# EasyEDA Pro project ProProject_赤兔主板（夜燕flex）_2024-07-11.epro, schematic 夜燕Flex
Create Date: 2024-04-10; Page Name: Sheet_1; Project Name: 夜燕Flex_2024-04-10_11-28-54; Schematic Name: 夜燕Flex; Update Date: 2024-05-22; Company: 嘉立创EDA; Page Size: A3; Version: V1.0
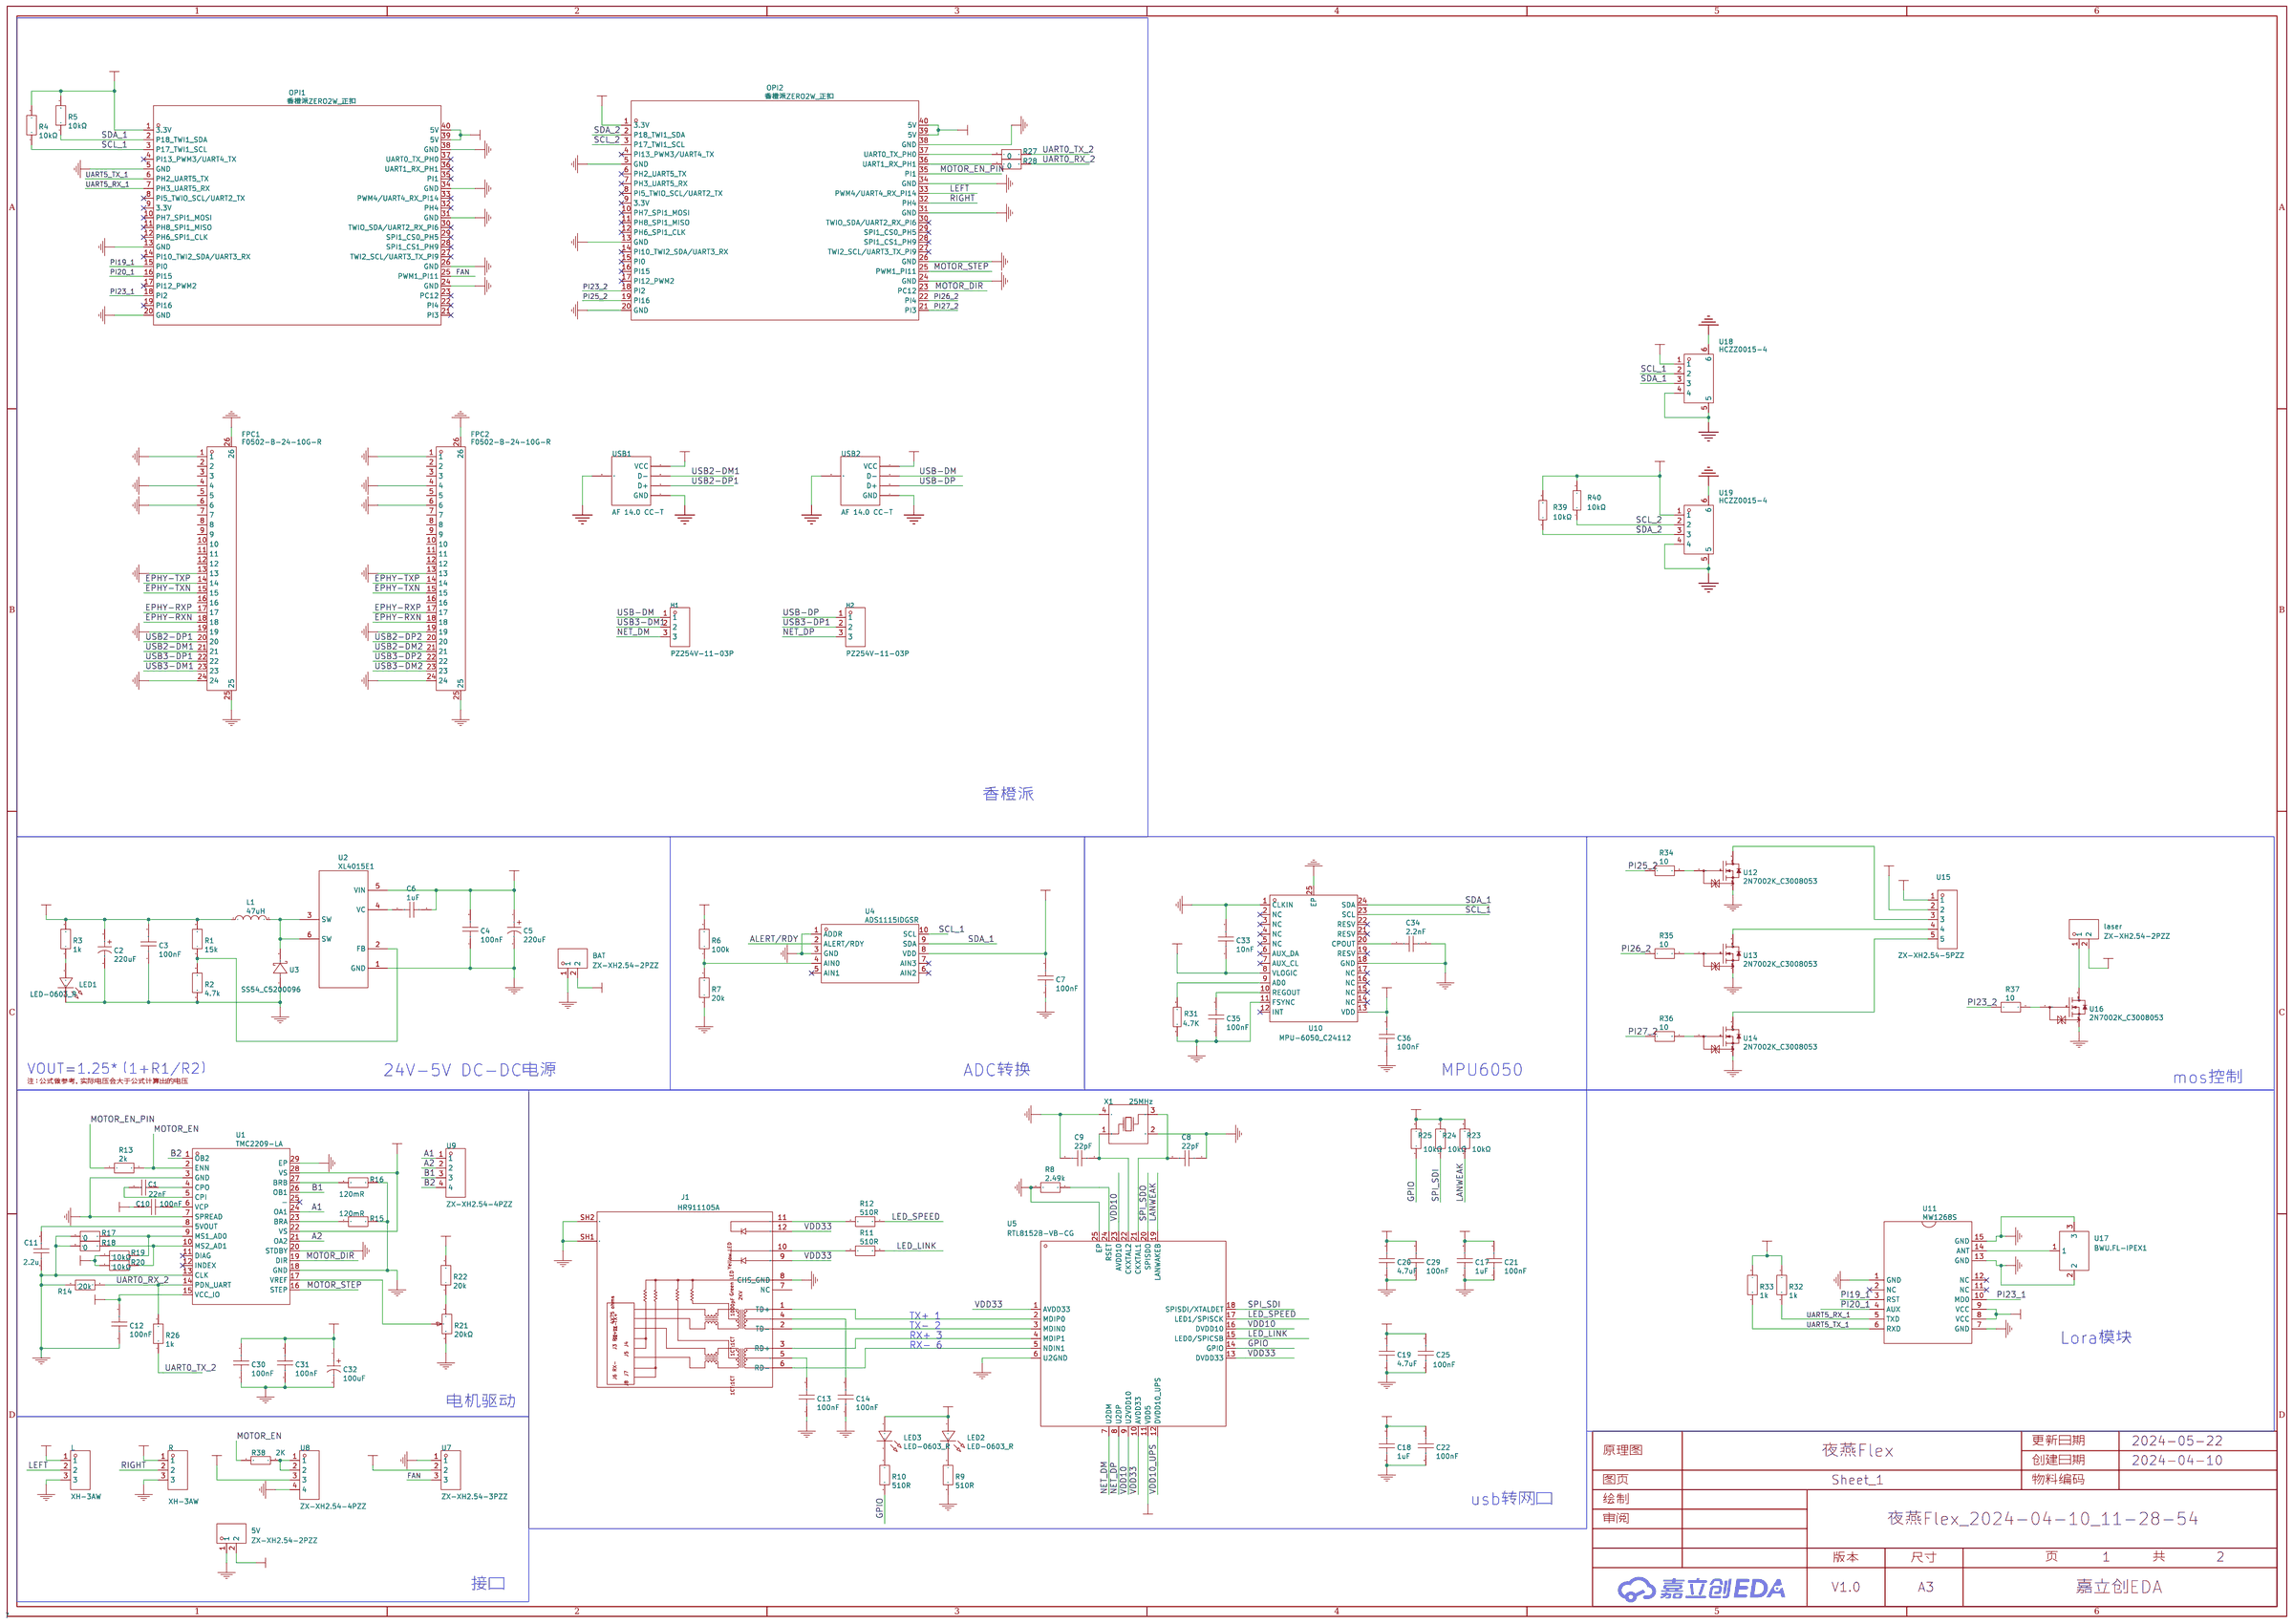
[diagram p0: schematic sheet]

## Parts
5V  ZX-XH2.54-2PZZ  [CONN-TH_2P-P2.50_HX25003-2A]
BAT  ZX-XH2.54-2PZZ  [CONN-TH_2P-P2.50_HX25003-2A]
C1  22nF  [C0603]
C2  220uF  [CAP-SMD_BD10.0-L10.3-W10.3-LS11.0-FD]
C3  100nF  [C0603]
C4  100nF  [C0603]
C5  220uF  [CAP-SMD_BD10.0-L10.3-W10.3-LS11.0-FD]
C6  1uF  [C0603]
C7  100nF  [C0603]
C8  22pF  [footprint_d276]
C9  22pF  [footprint_d276]
C10  100nF  [C0603]
C11  2.2u  [footprint_d276]
C12  100nF  [C0603]
C13  100nF  [C0603]
C14  100nF  [C0603]
C17  1uF  [C0603]
C18  1uF  [C0603]
C19  4.7uF  [C0603]
C20  4.7uF  [C0603]
C21  100nF  [C0603]
C22  100nF  [C0603]
C25  100nF  [C0603]
C29  100nF  [C0603]
C30  100nF  [C0603]
C31  100nF  [C0603]
C32  100uF  [CAP-SMD_BD6.3-L6.6-W6.6-LS7.4-FD]
C33  10nF  [C0603]
C34  2.2nF  [C0603]
C35  100nF  [C0603]
C36  100nF  [C0603]
FPC1  F0502-B-24-10G-R  [FPC-SMD_F0502-B-24-10G-R]
FPC2  F0502-B-24-10G-R  [FPC-SMD_F0502-B-24-10G-R]
H1  PZ254V-11-03P  [HDR-TH_3P-P2.54-V-M]
H2  PZ254V-11-03P  [HDR-TH_3P-P2.54-V-M]
J1  HR911105A  [RJ45-TH_HR911105A]
L  XH-3AW  [CONN-TH_3P-P2.54_HCTL_XH-3AW]
L1  47uH  [IND-SMD_L13.8-W12.6_YSPI13XX]
laser  ZX-XH2.54-2PZZ  [CONN-TH_2P-P2.50_HX25003-2A]
LED1  LED-0603_R  [footprint_3abe]
LED2  LED-0603_R  [footprint_3abe]
LED3  LED-0603_R  [footprint_3abe]
OPI1  香橙派ZERO2W_正扣  [footprint_d6d0]
OPI2  香橙派ZERO2W_正扣  [footprint_d6d0]
R  XH-3AW  [CONN-TH_3P-P2.54_HCTL_XH-3AW]
R1  15k  [footprint_b147]
R2  4.7k  [footprint_b147]
R3  1k  [footprint_b147]
R4  10kΩ  [R0603]
R5  10kΩ  [R0603]
R6  100k  [footprint_b147]
R7  20k  [footprint_b147]
R8  2.49k  [footprint_b147]
R9  510R  [footprint_b147]
R10  510R  [footprint_b147]
R11  510R  [footprint_b147]
R12  510R  [footprint_b147]
R13  2k  [footprint_b147]
R14  20k  [footprint_b147]
R15  120mR  [footprint_b147]
R16  120mR  [footprint_b147]
R17  0  [footprint_b147]
R18  0  [footprint_b147]
R19  10kΩ  [R0603]
R20  10kΩ  [R0603]
R21  20kΩ  [footprint_3e76]
R22  20k  [footprint_b147]
R23  10kΩ  [R0603]
R24  10kΩ  [R0603]
R25  10kΩ  [R0603]
R26  1k  [footprint_b147]
R27  0  [footprint_b147]
R28  0  [footprint_b147]
R31  4.7K  [R0603]
R32  1k  [R0603]
R33  1k  [R0603]
R34  10  [R0603]
R35  10  [R0603]
R36  10  [R0603]
R37  10  [R0603]
R38  2K  [R0603]
R39  10kΩ  [R0603]
R40  10kΩ  [R0603]
U1  TMC2209-LA  [footprint_e6f4]
U2  XL4015E1  [footprint_c660]
U3  SS54_C5200096  [footprint_a0e0]
U4  ADS1115IDGSR  [footprint_abbe]
U5  RTL8152B-VB-CG  [footprint_86b9]
U7  ZX-XH2.54-3PZZ  [CONN-TH_3P-P2.54_2501S-3P]
U8  ZX-XH2.54-4PZZ  [CONN-TH_4P-P2.50_4PIN]
U9  ZX-XH2.54-4PZZ  [CONN-TH_4P-P2.50_4PIN]
U10  MPU-6050_C24112  [QFN-24_L4.0-W4.0-P0.50-BL-EP2.7]
U11  MW1268S  [MW1268S]
U12  2N7002K_C3008053  [SOT-23-3_L2.9-W1.3-P1.90-LS2.4-BL-1]
U13  2N7002K_C3008053  [SOT-23-3_L2.9-W1.3-P1.90-LS2.4-BL-1]
U14  2N7002K_C3008053  [SOT-23-3_L2.9-W1.3-P1.90-LS2.4-BL-1]
U15  ZX-XH2.54-5PZZ  [CONN-TH_5P-P2.50_ZX-XH2.54-5PZZ]
U16  2N7002K_C3008053  [SOT-23-3_L2.9-W1.3-P1.90-LS2.4-BL-1]
U17  BWU.FL-IPEX1  [IPEX-SMD_BWIPX-1-001E]
U18  HCZZ0015-4  [CONN-SMD_4P-P1.25_HCZZ0015-4]
U19  HCZZ0015-4  [CONN-SMD_4P-P1.25_HCZZ0015-4]
USB1  AF 14.0 CC-T  [USB-A-TH_AF14.0CC-T]
USB2  AF 14.0 CC-T  [USB-A-TH_AF14.0CC-T]
X1  25MHz  [OSC-SMD_4P-L3.2-W2.5-BL]

## Library data of the parts
5V BAT laser = ZX-XH2.54-2PZZ: 插针结构:1x2P;间距:2.54mm;安装方式:直插;参考系列:XH;总PIN数:2P;排数:1;每排PIN数:2;行距:-;额定电流:3A;触头材质:黄铜;触头镀层:锡;工作温度范围:-25℃~+85℃;; Supplier Part: C7429632; Manufacturer: Megastar(兆星); Supplier Footprint: 插件,P=2.54mm; JLCPCB Part Class: 扩展库; Datasheet: https://atta.szlcsc.com/upload/public/pdf/source/20230619/19BA6947230AA44A04D3EDD65E618FD0.pdf; Supplier: LCSC; Pins Structure: 1x2P; Pitch: 2.54mm; Mounting Style: 直插; Reference Series: XH; Number of Pins: 2P; Number of Rows: 1; Number of PINs Per Row: 2; Current Rating (Max): 3A; Contact Material: 黄铜; Contact Plating: 锡; Operating Temperature Range: -25℃~+85℃
C1 = CL10B223KB8NNNC: 容值:22nF;精度:±10%;额定电压:50V;材质(温度系数):X7R;; LCSC Part Name: 22nF ±10% 50V; Supplier Part: C21122; Manufacturer: SAMSUNG(三星); Supplier Footprint: 0603; JLCPCB Part Class: Basic Part; Datasheet: https://atta.szlcsc.com/upload/public/pdf/source/20160218/1457707763339.pdf; Supplier: LCSC; Tolerance: ±10%; Voltage Rated: 50V; Temperature Coefficient: X7R
C2 C5 = RVT220UF50V67RV0021: 容值:220uF;精度:±20%;额定电压:50V;纹波电流:230mA@120Hz;等效串联电阻:-;; LCSC Part Name: 220uF ±20% 50V; Supplier Part: C2887271; Manufacturer: KNSCHA(科尼盛); Supplier Footprint: SMD,D10xL10.2mm; JLCPCB Part Class: Extended Part; Datasheet: https://atta.szlcsc.com/upload/public/pdf/source/20210824/08E695BB4B7EEB96F38ACC5D13E6017A.pdf; Supplier: LCSC; Tolerance: ±20%; Rated Voltage: 50V; Ripple Current: 230mA@120Hz; φD: 10mm; L: 10.2mm; Lifetime @ Temp: 2000hrs@105℃; Operating Temperature: -55℃~+105℃
C3 C4 C7 C10 C12-C14 C21 C22 C25 C29-C31 C35 C36 = CC0603KRX7R9BB104: 容值:100nF;精度:±10%;额定电压:50V;材质(温度系数):X7R;; LCSC Part Name: 100nF ±10% 50V; Supplier Part: C14663; Manufacturer: YAGEO(国巨); Supplier Footprint: 0603; JLCPCB Part Class: Basic Part; Datasheet: https://atta.szlcsc.com/upload/public/pdf/source/20180910/C282072_33301C7F631E79921B82A8DAC6BCC5B3.pdf; Supplier: LCSC; Tolerance: ±10%; Voltage Rated: 50V; Temperature Coefficient: X7R
C6 C17 C18 = CL10A105KB8NNNC: 容值:1uF;精度:±10%;额定电压:50V;材质(温度系数):X5R;; LCSC Part Name: 1uF ±10% 50V; Supplier Part: C15849; Manufacturer: SAMSUNG(三星); Supplier Footprint: 0603; JLCPCB Part Class: Basic Part; Datasheet: https://atta.szlcsc.com/upload/public/pdf/source/20160218/1457707763339.pdf; Supplier: LCSC; Tolerance: ±10%; Voltage Rated: 50V; Temperature Coefficient: X5R
C8 C9 = 22pF
C11 = 2.2u
C19 C20 = CL10A475KO8NNNC: 容值:4.7uF;精度:±10%;额定电压:16V;材质(温度系数):X5R;; LCSC Part Name: 4.7uF ±10% 16V; Supplier Part: C19666; Manufacturer: SAMSUNG(三星); Supplier Footprint: 0603; JLCPCB Part Class: Basic Part; Datasheet: https://atta.szlcsc.com/upload/public/pdf/source/20160218/1457707763339.pdf; Supplier: LCSC; Tolerance: ±10%; Voltage Rated: 16V; Temperature Coefficient: X5R
C32 = RVT100UF35V67RV0034: 容值:100uF;精度:±20%;额定电压:35V;纹波电流:87mA@120kHz;等效串联电阻:-;; LCSC Part Name: 100uF ±20% 35V; Supplier Part: C2836442; Manufacturer: KNSCHA(科尼盛); Supplier Footprint: SMD,D6.3xL7.7mm; JLCPCB Part Class: Extended Part; Datasheet: https://atta.szlcsc.com/upload/public/pdf/source/20210528/C2836442_7F6389BF36F63F32D6DF3A507E8E95D6.pdf; Supplier: LCSC; Tolerance: ±20%; Rated Voltage: 35V; Ripple Current: 87mA@120kHz; φD: 6.3mm; L: 7.7mm; Lifetime @ Temp: 2000hrs@105℃; Operating Temperature: -55℃~+105℃
C33 = CC0603KRX7R9BB103: 容值:10nF;精度:±10%;额定电压:50V;材质(温度系数):X7R;; LCSC Part Name: 10nF ±10% 50V; Supplier Part: C100042; Manufacturer: YAGEO(国巨); Supplier Footprint: 0603; JLCPCB Part Class: Extended Part; Datasheet: https://atta.szlcsc.com/upload/public/pdf/source/20181008/C309510_22F155564471FAF6A489F7D68F34234E.pdf; Supplier: LCSC; Tolerance: ±10%; Voltage Rated: 50V; Temperature Coefficient: X7R
C34 = 0603B222K500NT: 容值:2.2nF;精度:±10%;额定电压:50V;材质(温度系数):X7R;; LCSC Part Name: 2.2nF ±10% 50V; Supplier Part: C1604; Manufacturer: FH(风华); Supplier Footprint: 0603; JLCPCB Part Class: Basic Part; Datasheet: https://atta.szlcsc.com/upload/public/pdf/source/20200305/C486355_26A10D38EF8C2A5C37091D0039909270.pdf; Supplier: LCSC; Tolerance: ±10%; Voltage Rated: 50V; Temperature Coefficient: X7R
FPC1 FPC2 = F0502-B-24-10G-R: 锁定特性:翻盖式;触点类型:下接;触点数量:24P;间距:0.5mm;安装类型:卧贴;; LCSC Part Name: 间距:0.5mm P数:24P 翻盖式 下接; Supplier Part: C512913; Manufacturer: XFCN(兴飞); Supplier Footprint: SMD,P=0.5mm,卧贴; JLCPCB Part Class: 扩展库; Datasheet: https://atta.szlcsc.com/upload/public/pdf/source/20200414/C512913_E6E4687019ED01A465E23E78A69614FB.pdf; Supplier: LCSC; Locking Feature: 翻盖式; Contact Type: 下接; Number of Contacts: 24P; Pitch: 0.5mm; Mounting Type: 卧贴; FFC, FCB Thickness: 0.3mm; Height Above Board: 1mm
H1 H2 = PZ254V-11-03P: 插针结构:1x3P;间距:2.54mm;行距:-;圆针/方针:方针;安装类型:直插;排数:单排;总PIN位数:3P;额定电流:3A;额定电压:250V;配合针长度:6mm;塑高:2.5mm;端接针长度:3mm;工作温度范围:-40℃~+105℃;颜色:黑色;; LCSC Part Name: 间距:2.54mm 1x3P 直插 方针; Supplier Part: C2937625; Manufacturer: XFCN(兴飞); Supplier Footprint: 插件,P=2.54mm; JLCPCB Part Class: 扩展库; Datasheet: https://atta.szlcsc.com/upload/public/pdf/source/20200309/C492402_8335C3D49C4E4C618838D59BB1D024C1.pdf; Supplier: LCSC; Pin Structure: 1x3P; Pitch: 2.54mm; Circluar Pins/Square Pins: 方针; Mounting Type: 直插; Number of Rows: 单排; Number of Pins: 3P; Current Rating (Max): 3A; Voltage Rating (Max): 250V; Length of Mating Pin: 6mm; Insulation Height: 2.5mm; Length of End Connection Pin: 3mm; Operating Temperature Range: -40℃~+105℃; Color: 黑色
J1 = HR911105A_C12074: 连接器类型:RJ45插座;端口数量:1;安装方式:-;屏蔽:-;LED:带LED;等级:-;触头材质:-;触头镀层:-;工作温度范围:-;焊接温度(最大值):-;; LCSC Part Name: 带LED; Supplier Part: C12074; Manufacturer: HANRUN(汉仁); Supplier Footprint: 插件; JLCPCB Part Class: Extended Part; Datasheet: https://atta.szlcsc.com/upload/public/pdf/source/20170918/C12074_1505726819496976146.pdf; Supplier: LCSC; Connector Type: RJ45插座; Number of Ports: 1; LED: 带LED; PoE: 不带PoE; Supplementary Features: 带滤波
L R = XH-3AW_C2908612: 插针结构:1x3P;间距:2.54mm;安装方式:弯插;参考系列:XH;总PIN数:3P;排数:1;每排PIN数:3;行距:-;额定电流:3A;触头材质:黄铜;触头镀层:锡;工作温度范围:-25℃~+85℃;; LCSC Part Name: 1x3P 间距:2.54mm 弯插 系列:XH; Supplier Part: C2908612; Manufacturer: HCTL(华灿天禄); Supplier Footprint: 弯插,P=2.54mm; JLCPCB Part Class: 扩展库; Datasheet: https://atta.szlcsc.com/upload/public/pdf/source/20230711/B565BAF3B11666EF6B81B3605408F2BD.pdf; Supplier: LCSC; Pins Structure: 1x3P; Pitch: 2.54mm; Mounting Style: 弯插; Reference Series: XH; Number of Pins: 3P; Number of Rows: 1; Number of PINs Per Row: 3; Current Rating (Max): 3A; Contact Material: 黄铜; Contact Plating: 锡; Operating Temperature Range: -25℃~+85℃
L1 = YSPI1365-470M: 电感值:47uH;精度:±20%;额定电流:5A;; LCSC Part Name: 47uH ±20%; Supplier Part: C497913; Manufacturer: YJYCOIN(益嘉源); Supplier Footprint: SMD,13.8x12.6x6.5mm; JLCPCB Part Class: Extended Part; Datasheet: https://atta.szlcsc.com/upload/public/pdf/source/20230801/AED9D02F50D39DFEE57BC1CE3E1D3DA7.pdf; Supplier: LCSC; Tolerance: ±20%; Rated Current: 5A; DC Resistance (DCR): 57.5mΩ
LED1-LED3 = LED-0603_R: Manufacturer: EVERLIGHT(台湾亿光); Manufacturer Part: 19-217/R6C-AL1M2VY/3T; Supplier Part: C72044; Supplier: LCSC
OPI1 OPI2 = 香橙派ZERO2W_正扣: Manufacturer: ORANGE_PI
R1 = 10.5k
R2 = 2k
R3 R26 R32 R33 = 1k
R4 R5 R19 R20 R23-R25 R39 R40 = 0603WAF1002T5E: 电阻类型:厚膜电阻;阻值:10kΩ;精度:±1%;功率:100mW;最大工作电压:75V;温度系数:±100ppm/℃;; LCSC Part Name: 厚膜电阻 10kΩ ±1% 100mW; Supplier Part: C25804; Manufacturer: UNI-ROYAL(厚声); Supplier Footprint: 0603; JLCPCB Part Class: Basic Part; Datasheet: https://atta.szlcsc.com/upload/public/pdf/source/20200306/C422600_1E6D84923E4A46A82E41ADD87F860B5C.pdf; Supplier: LCSC; Type: 厚膜电阻; Tolerance: ±1%; Power(Watts): 100mW; Overload Voltage (Max): 75V; Temperature Coefficient: ±100ppm/℃; Operating Temperature Range: -55℃~+155℃
R6 = 100k
R7 R14 R22 = 20k
R8 = 2.49k
R9-R12 = 510R
R13 = 10k
R15 R16 = 120mR
R17 R18 R27 R28 = 0
R21 = 20kΩ: Resistance: 20K; Supplier: LCSC; Manufacturer: HDK(北陆电气); Manufacturer Part: VG039NCHXTB203; Supplier Part: C128550; JLCPCB Part Class: Extended Part
R31 = 4.7K: Supplier: LCSC; Manufacturer: UNI-ROYAL(厚声); Manufacturer Part: 0603WAF4701T5E; Supplier Part: C23162; JLCPCB Part Class: Basic Part
R34-R37 = 10
R38 = Res_0603: Supplier Footprint: 0603
U1 = TMC2209-LA: Supplier: LCSC; Supplier Part: C465949; Manufacturer: TRINAMIC; JLCPCB Part Class: Extended Part
U2 = XL4015E1: Supplier: LCSC; Manufacturer: XLSEMI(芯龙); Supplier Part: C51661; JLCPCB Part Class: Extended Part
U3 = SS54_C5200096: Supplier: LCSC; Supplier Part: C5200096; Manufacturer: HXY MOSFET(华轩阳电子); Manufacturer Part: SS54; JLCPCB Part Class: Extended Part
U4 = ADS1115IDGSR: Supplier: LCSC; Manufacturer: TI(德州仪器); Supplier Part: C37593; JLCPCB Part Class: Extended Part
U5 = RTL8152B-VB-CG: Supplier: LCSC; Manufacturer: REALTEK; Supplier Part: C50656; JLCPCB Part Class: Extend
U7 = ZX-XH2.54-3PZZ: 插针结构:1x3P;间距:2.54mm;安装方式:直插;参考系列:XH;总PIN数:3P;排数:1;每排PIN数:3;行距:-;额定电流:3A;触头材质:黄铜;触头镀层:锡;工作温度范围:-25℃~+85℃;; Supplier Part: C7429633; Manufacturer: Megastar(兆星); Supplier Footprint: 插件,P=2.54mm; JLCPCB Part Class: 扩展库; Datasheet: https://atta.szlcsc.com/upload/public/pdf/source/20230619/AE17037A2CFDBE8D9CBA775D61AD0A84.pdf; Supplier: LCSC; Pins Structure: 1x3P; Pitch: 2.54mm; Mounting Style: 直插; Reference Series: XH; Number of Pins: 3P; Number of Rows: 1; Number of PINs Per Row: 3; Current Rating (Max): 3A; Contact Material: 黄铜; Contact Plating: 锡; Operating Temperature Range: -25℃~+85℃
U8 U9 = ZX-XH2.54-4PZZ: 插针结构:1x4P;间距:2.54mm;安装方式:直插;参考系列:XH;总PIN数:4P;排数:1;每排PIN数:4;行距:-;额定电流:3A;触头材质:黄铜;触头镀层:锡;工作温度范围:-25℃~+85℃;; Supplier Part: C7429634; Manufacturer: Megastar(兆星); Supplier Footprint: 插件,P=2.54mm; JLCPCB Part Class: 扩展库; Datasheet: https://atta.szlcsc.com/upload/public/pdf/source/20230619/B529A2163E0159A644AB3383D208FB03.pdf; Supplier: LCSC; Pins Structure: 1x4P; Pitch: 2.54mm; Mounting Style: 直插; Reference Series: XH; Number of Pins: 4P; Number of Rows: 1; Number of PINs Per Row: 4; Current Rating (Max): 3A; Contact Material: 黄铜; Contact Plating: 锡; Operating Temperature Range: -25℃~+85℃
U10 = MPU-6050_C24112: Supplier: LCSC; Manufacturer: TDK InvenSense(应美盛); Manufacturer Part: MPU-6050; Supplier Part: C24112; JLCPCB Part Class: Extended Part
U11 = MW1268S
U12-U14 U16 = 2N7002K_C3008053: Supplier: LCSC; Supplier Part: C3008053; Manufacturer: MSKSEMI(美森科); Manufacturer Part: 2N7002K; JLCPCB Part Class: Extended Part
U15 = ZX-XH2.54-5PZZ: Supplier: LCSC; Supplier Part: C7429635; Manufacturer: Megastar(兆星); JLCPCB Part Class: Extended Part
U17 = BWU.FL-IPEX1: 连接器类型:板端;接口类型:内针;端口数量:1;接口直径:2mm;接口长度/高度:1.25mm;频率-最大值:6GHz;射频系列:IPEX;阻抗:50Ω;样式:-;触头材质:-;触头镀层:-;工作温度范围:-;焊接温度(最大值):-;; LCSC Part Name: 内针 IPEX; Supplier Part: C5137195; Manufacturer: BAT WIRELESS(蝙蝠无线); Supplier Footprint: SMD; JLCPCB Part Class: 扩展库; Datasheet: https://atta.szlcsc.com/upload/public/pdf/source/20220815/058ABE525AAE400925F1A3839AB872AC.pdf; Supplier: LCSC; Connector Type: 板端; Interface Type: 内针; Number of Ports: 1; Interface Diameter: 2mm; Interface Length/Height: 1.25mm; Frequency-Max: 6GHz; RF Series: IPEX; Impedance: 50Ω
U18 U19 = HCZZ0015-4: 插针结构:1x4P;间距:1.25mm;安装方式:立贴;参考系列:GH;总PIN数:4P;排数:1;每排PIN数:4;额定电流:1A;触头材质:黄铜;触头镀层:锡;工作温度范围:-25℃~+85℃;; LCSC Part Name: 1x4P 间距:1.25mm 立贴 系列:GH 米色; Supplier Part: C7433470; Manufacturer: HC(虹成电子); Supplier Footprint: SMD,P=1.25mm; JLCPCB Part Class: 扩展库; Datasheet: https://atta.szlcsc.com/upload/public/pdf/source/20230626/E093BA82093E35F6556425E18E61B082.pdf; Supplier: LCSC; Pins Structure: 1x4P; Pitch: 1.25mm; Mounting Style: 立贴; Reference Series: GH; Number of Pins: 4P; Number of Rows: 1; Number of PINs Per Row: 4; Current Rating (Max): 1A; Contact Material: 黄铜; Contact Plating: 锡; Operating Temperature Range: -25℃~+85℃
USB1 USB2 = AF 14.0 CC-T: 连接器类型:Type-A;标准:USB 2.0;公母:母;端口数量:1;触点数量:4P;安装方式:侧插;额定电流 - 电源:1.5A;工作温度范围:-55℃~+85℃;; LCSC Part Name: Type-A 母 侧插; Supplier Part: C456020; Manufacturer: SHOU HAN(首韩); Supplier Footprint: 插件; JLCPCB Part Class: 扩展库; Datasheet: https://atta.szlcsc.com/upload/public/pdf/source/20191113/C456020_39FBC8225D994203A48A0A8F354A438E.pdf; Supplier: LCSC; Connector Type: Type-A; Standard: USB 2.0; Gender: 母; Number of Ports: 1; Number of Contacts: 4P; Mounting Style: 侧插; Current Rating - Power (Max): 1.5A; Operating Temperature Range: -55℃~+85℃
X1 = X322525MOB4SI: 晶振类型:贴片晶振;频率:25MHz;常温频差:±10ppm;外接负载电容:12pF;频率稳定度(全温):±20ppm;; LCSC Part Name: 25MHz ±10ppm 12pF; Supplier Part: C9006; Manufacturer: YXC(扬兴晶振); Supplier Footprint: SMD3225-4P; JLCPCB Part Class: Basic Part; Datasheet: https://atta.szlcsc.com/upload/public/pdf/source/20240329/19D5F850207469550BEB00D7DFEDBC7A.pdf; Supplier: LCSC; Crystal Type: 贴片晶振; Normal temperature Frequency Tolerance: ±10ppm; External load capacitor: 12pF; Frequency Stability(Full temperature range): ±20ppm; Operating Temperature: -40℃~+85℃

## Nets
3V3: C36.2 U10.13(VDD)
3V3_1: C33.1 OPI1.1(3.3V) R4.2 R5.2 R32.1 R33.1 U10.8(VLOGIC) U18.1
3V3_2: OPI2.1(3.3V) R39.2 R40.2 U8.3 U19.1
24V: BAT.2 C4.2 C5.1 C6.2 C10.1 C30.2 C31.2 C32.1 R6.2 U1.22(VS) U1.28(VS) U2.5(VIN) U7.2 U15.1
+5V: 5V.2 C2.1 C3.2 C7.2 C12.2 C20.2 C29.2 L.1 L1.1 laser.2 OPI1.39(5V) OPI1.40(5V) OPI2.39(5V) OPI2.40(5V) R.1 R1.2 R3.2 R19.1 R20.1 R22.2 U1.15(VCC_IO) U4.8(VDD) U5.11(VDD5) U11.8(VCC) U11.9(VCC) U15.2 USB1.1(VCC) USB2.1(VCC)
GND: 5V.1 BAT.1 C2.2 C3.1 C4.1 C5.2 C7.1 C8.1 C9.2 C11.1 C12.1 C13.1 C14.1 C17.1 C18.1 C19.1 C20.1 C21.1 C22.1 C25.1 C29.1 C30.1 C31.1 C32.2 C33.2 C34.2 C35.2 C36.1 FPC1.1 FPC1.4 FPC1.6 FPC1.13 FPC1.19 FPC1.24 FPC1.25 FPC1.26 FPC2.1 FPC2.4 FPC2.6 FPC2.13 FPC2.19 FPC2.24 FPC2.25 FPC2.26 J1.8(CHS GND) J1.SH1 J1.SH2 L.3 LED1.2 OPI1.5(GND) OPI1.13(GND) OPI1.20(GND) OPI1.24(GND) OPI1.26(GND) OPI1.31(GND) OPI1.34(GND) OPI1.38(GND) OPI2.5(GND) OPI2.13(GND) OPI2.20(GND) OPI2.24(GND) OPI2.26(GND) OPI2.31(GND) OPI2.34(GND) OPI2.38(GND) R.3 R2.1 R7.1 R8.2 R9.2 R14.1 R15.2 R16.2 R17.1 R18.1 R21.1 R31.1 U1.3(GND) U1.7(SPREAD) U1.13(CLK) U1.18(GND) U1.20(STDBY) U1.29(EP) U2.1(GND) U3.1(A) U4.1(ADDR) U4.3(GND) U5.6(U2GND) U5.25(EP) U7.1 U8.4 U10.1(CLKIN) U10.11(FSYNC) U10.18(GND) U10.25(EP) U11.1(GND) U11.7(GND) U11.13(GND) U11.15(GND) U12.2(S) U13.2(S) U14.2(S) U16.2(S) U17.2 U17.3 U18.4 U18.5 U18.6 U19.4 U19.5 U19.6 USB1.4(GND) USB1.5(SHLD) USB2.4(GND) USB2.5(SHLD) X1.2(GND) X1.4(GND)
VDD10: C18.2 C22.2 U5.9(U2VDD10) U5.16(DVDD10) U5.23(AVDD10)
VDD10_UPS: C17.2 C21.2 U5.12(DVDD10_UPS)
VDD33: C19.2 C25.2 J1.9 J1.12 LED2.1 LED3.1 R23.2 R24.2 R25.2 U5.1(AVDD33) U5.10(AVDD33) U5.13(DVDD33)
A1: U1.24(OA1) U9.1
A2: U1.21(OA2) U9.2
ALERT/RDY: U4.2(ALERT/RDY)
B1: U1.26(OB1) U9.3
B2: U1.1(OB2) U9.4
EPHY-RXN: FPC1.18 FPC2.18
EPHY-RXP: FPC1.17 FPC2.17
EPHY-TXN: FPC1.15 FPC2.15
EPHY-TXP: FPC1.14 FPC2.14
FAN: OPI1.25(PWM1 PI11) U7.3
GPIO: R10.2 R25.1 U5.14(GPIO)
LANWEAK: R23.1 U5.19(LANWAKEB)
LED_LINK: R11.1 U5.15(LED0/SPICSB)
LED_SPEED: R12.1 U5.17(LED1/SPISCK)
LEFT: L.2 OPI2.33(PWM4/UART4_RX PI14)
MOTOR_DIR: OPI2.23(PC12) U1.19(DIR)
MOTOR_EN: R13.2 R38.1 U1.2(ENN)
MOTOR_EN_PIN: OPI2.35(PI1) R13.1
MOTOR_STEP: OPI2.25(PWM1 PI11) U1.16(STEP)
NET_DM: H1.3 U5.7(U2DM)
NET_DP: H2.3 U5.8(U2DP)
PI19_1: OPI1.15(PI0) U11.3(RST)
PI20_1: OPI1.16(PI15) U11.4(AUX)
PI23_1: OPI1.18(PI2) U11.10(MD0)
PI23_2: OPI2.18(PI2) R37.1
PI25_2: OPI2.19(PI16) R34.1
PI26_2: OPI2.22(PI4) R35.1
PI27_2: OPI2.21(PI3) R36.1
RIGHT: OPI2.32(PH4) R.2
SCL_1: OPI1.3(P17 TWI1_SCL) R4.1 U4.10(SCL) U10.23(SCL) U18.2
SCL_2: OPI2.3(P17 TWI1_SCL) R40.1 U19.2
SDA_1: OPI1.2(P18 TWI1_SDA) R5.1 U4.9(SDA) U10.24(SDA) U18.3
SDA_2: OPI2.2(P18 TWI1_SDA) R39.1 U19.3
SPI_SDI: R24.1 U5.18(SPISDI/XTALDET)
SPI_SDO: U5.20(SPISDO)
UART0_RX_2: R14.2 R26.2 R28.2 U1.14(PDN_UART)
UART0_TX_2: R26.1 R27.2
UART5_RX_1: OPI1.7(PH3 UART5_RX) R32.2 U11.5(TXD)
UART5_TX_1: OPI1.6(PH2 UART5_TX) R33.2 U11.6(RXD)
USB2-DM1: FPC1.21 USB1.2(D-)
USB2-DM2: FPC2.21
USB2-DP1: FPC1.20 USB1.3(D+)
USB2-DP2: FPC2.20
USB3-DM1: FPC1.23 H1.2
USB3-DM2: FPC2.23
USB3-DP1: FPC1.22 H2.2
USB3-DP2: FPC2.22
USB-DM: H1.1 USB2.2(D-)
USB-DP: H2.1 USB2.3(D+)
$2N1: C1.2 U1.4(CPO)
$2N2: C1.1 U1.5(CPI)
$2N3: L1.2 U2.3(SW) U2.6(SW) U3.2(K)
$2N9: R1.1 R2.2 U2.2(FB)
$2N10: C6.1 U2.4(VC)
$2N13: LED1.1 R3.1
$2N22: R6.1 R7.2 U4.4(AIN0)
$2N25: R8.1 U5.24(RSET)
$2N45: C8.2 U5.21(CKXTAL1) X1.3(OSC2)
$2N46: C9.1 U5.22(CKXTAL2) X1.1(OSC1)
$2N58: J1.11 R12.2
$2N73: C10.2 U1.6(VCP)
$2N74: C11.2 U1.8(5VOUT)
$2N79: R16.1 U1.27(BRB)
$2N80: R15.1 U1.23(BRA)
$2N83: R17.2 R19.2 U1.9(MS1_AD0)
$2N84: R18.2 R20.2 U1.10(MS2_AD1)
$2N89: R21.3 R22.1
$2N91: R21.2 U1.17(VREF)
$2N165: OPI2.37(UART0_TX PH0) R27.1
$2N166: OPI2.36(UART1_RX PH1) R28.1
$2N178: J1.10 R11.2
$2N181: J1.1(TD+) U5.2(MDIP0)
$2N182: J1.2(TD-) U5.3(MDIN0)
$2N183: J1.3(RD+) U5.4(MDIP1)
$2N184: J1.6(RD-) U5.5(NDIN1)
$2N185: C14.2 J1.4
$2N186: C13.2 J1.5
$2N1673: LED2.2 R9.1
$2N1674: LED3.2 R10.1
$2N7600: R38.2 U8.1 U8.2
$2N16339: C35.1 U10.10(REGOUT)
$2N16346: C34.1 U10.20(CPOUT)
$2N16349: R31.2 U10.9(AD0)
$2N24169: U11.14(ANT) U17.1
$2N24402: R34.2 U12.1(G)
$2N24403: R35.2 U13.1(G)
$2N24404: R36.2 U14.1(G)
$2N24408: U14.3(D) U15.5
$2N24409: U13.3(D) U15.4
$2N24410: U12.3(D) U15.3
$2N24486: R37.2 U16.1(G)
$2N28210: laser.1 U16.3(D)

Not connected (* = marked no-connect by the designer): FPC1 2 3 5 7 8 9 10 11 12 16; FPC2 2 3 5 7 8 9 10 11 12 16; J1 7(NC); OPI1 4(PI13 PWM3/UART4_TX)* 8(PI5 TWIO_SCL/UART2_TX)* 9(3.3V)* 10(PH7 SPI1_MOSI)* 11(PH8 SPI1_MISO)* 12(PH6 SPI1_CLK)* 14(PI10 TWI2_SDA/UART3_RX)* 17(PI12 PWM2)* 19(PI16)* 21(PI3)* 22(PI4)* 23(PC12)* 27(TWI2_SCL/UART3_TX PI9)* 28(SPI1_CS1 PH9)* 29(SPI1_CS0 PH5)* 30(TWIO_SDA/UART2_RX PI6)* 32(PH4)* 33(PWM4/UART4_RX PI14)* 35(PI1)* 36(UART1_RX PH1)* 37(UART0_TX PH0)*; OPI2 4(PI13 PWM3/UART4_TX)* 6(PH2 UART5_TX)* 7(PH3 UART5_RX)* 8(PI5 TWIO_SCL/UART2_TX)* 9(3.3V)* 10(PH7 SPI1_MOSI)* 11(PH8 SPI1_MISO)* 12(PH6 SPI1_CLK)* 14(PI10 TWI2_SDA/UART3_RX)* 15(PI0)* 16(PI15)* 17(PI12 PWM2)* 27(TWI2_SCL/UART3_TX PI9)* 28(SPI1_CS1 PH9)* 29(SPI1_CS0 PH5)* 30(TWIO_SDA/UART2_RX PI6)*; U1 11(DIAG)* 12(INDEX)* 25(-)*; U4 5(AIN1)* 6(AIN2)* 7(AIN3)*; U10 2(NC)* 3(NC)* 4(NC)* 5(NC)* 6(AUX_DA)* 7(AUX_CL)* 12(INT)* 14(NC)* 15(NC)* 16(NC)* 17(NC)* 19(RESV)* 21(RESV)* 22(RESV)*; U11 2(NC)* 11(NC)* 12(NC)*

## Notes on the sheet
- 香橙派
- VOUT=1.25*（1+R1/R2）
- 24V-5V DC-DC电源
- ADC转换
- MPU6050
- 注：公式做参考，实际电压会大于公式计算出的电压
- mos控制
- TX+ 1
- TX- 2
- RX+ 3
- RX- 6
- Lora模块
- 电机驱动
- usb转网口
- 接口
